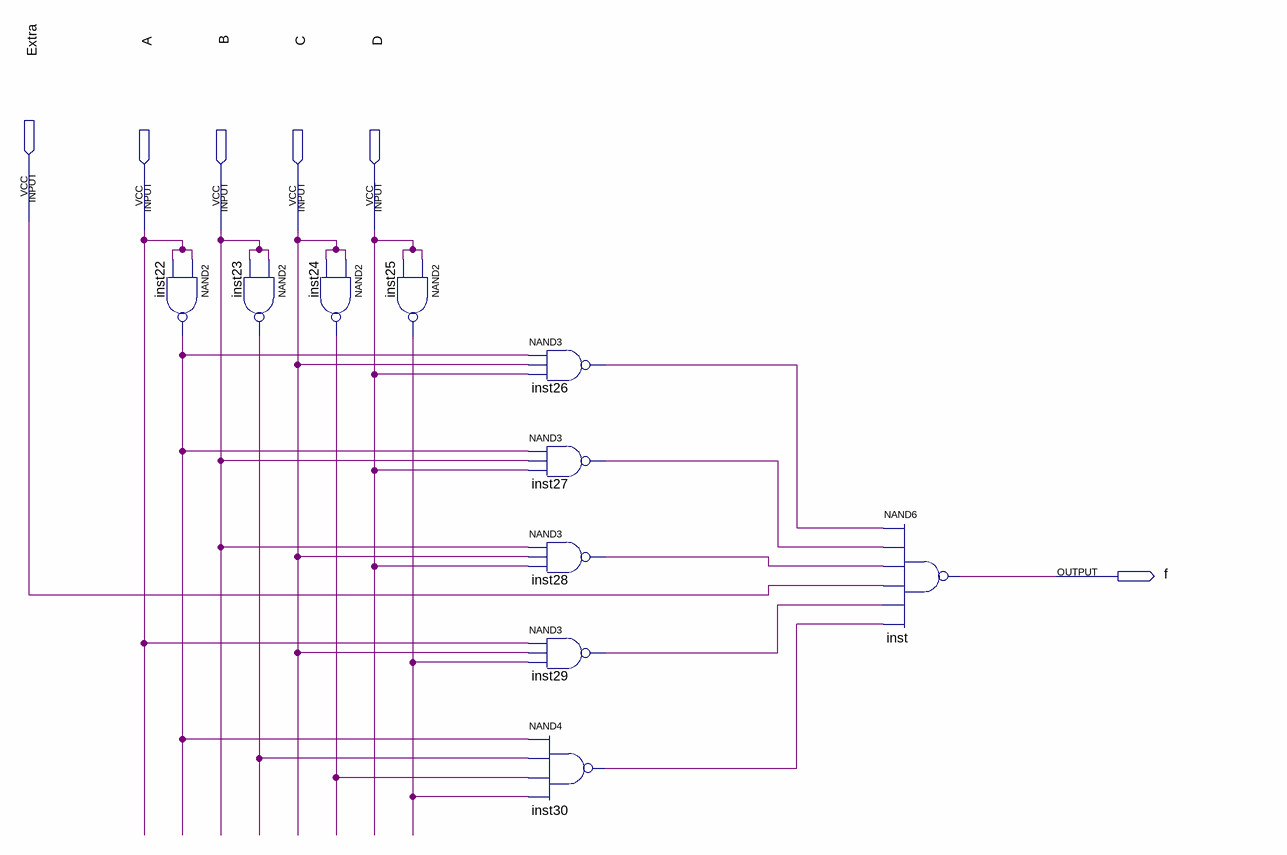
[diagram p0: schematic sheet]
// Quartus schematic lab2.bdf as structural Verilog: 10 symbols, 6 pins
module lab2 (
  input  Extra,
  input  A,
  input  B,
  input  C,
  input  D,
  output f
);

  wire inst22_out, inst23_out, inst24_out, inst25_out, inst26_out, inst27_out, inst28_out, inst29_out,
       inst30_out;

  nand inst22 (inst22_out, A, A);
  nand inst23 (inst23_out, B, B);
  nand inst24 (inst24_out, C, C);
  nand inst25 (inst25_out, D, D);
  nand inst26 (inst26_out, inst22_out, C, D);
  nand inst27 (inst27_out, inst22_out, B, D);
  nand inst28 (inst28_out, B, C, D);
  nand inst29 (inst29_out, A, C, inst25_out);
  nand inst30 (inst30_out, inst22_out, inst23_out, inst24_out, inst25_out);
  nand inst (f, inst26_out, inst27_out, inst28_out, Extra, inst29_out, inst30_out);
endmodule
